# EAGLE design Board_with_LDC1614_no_ind_blink_V4 (EAGLE 9.6.2)
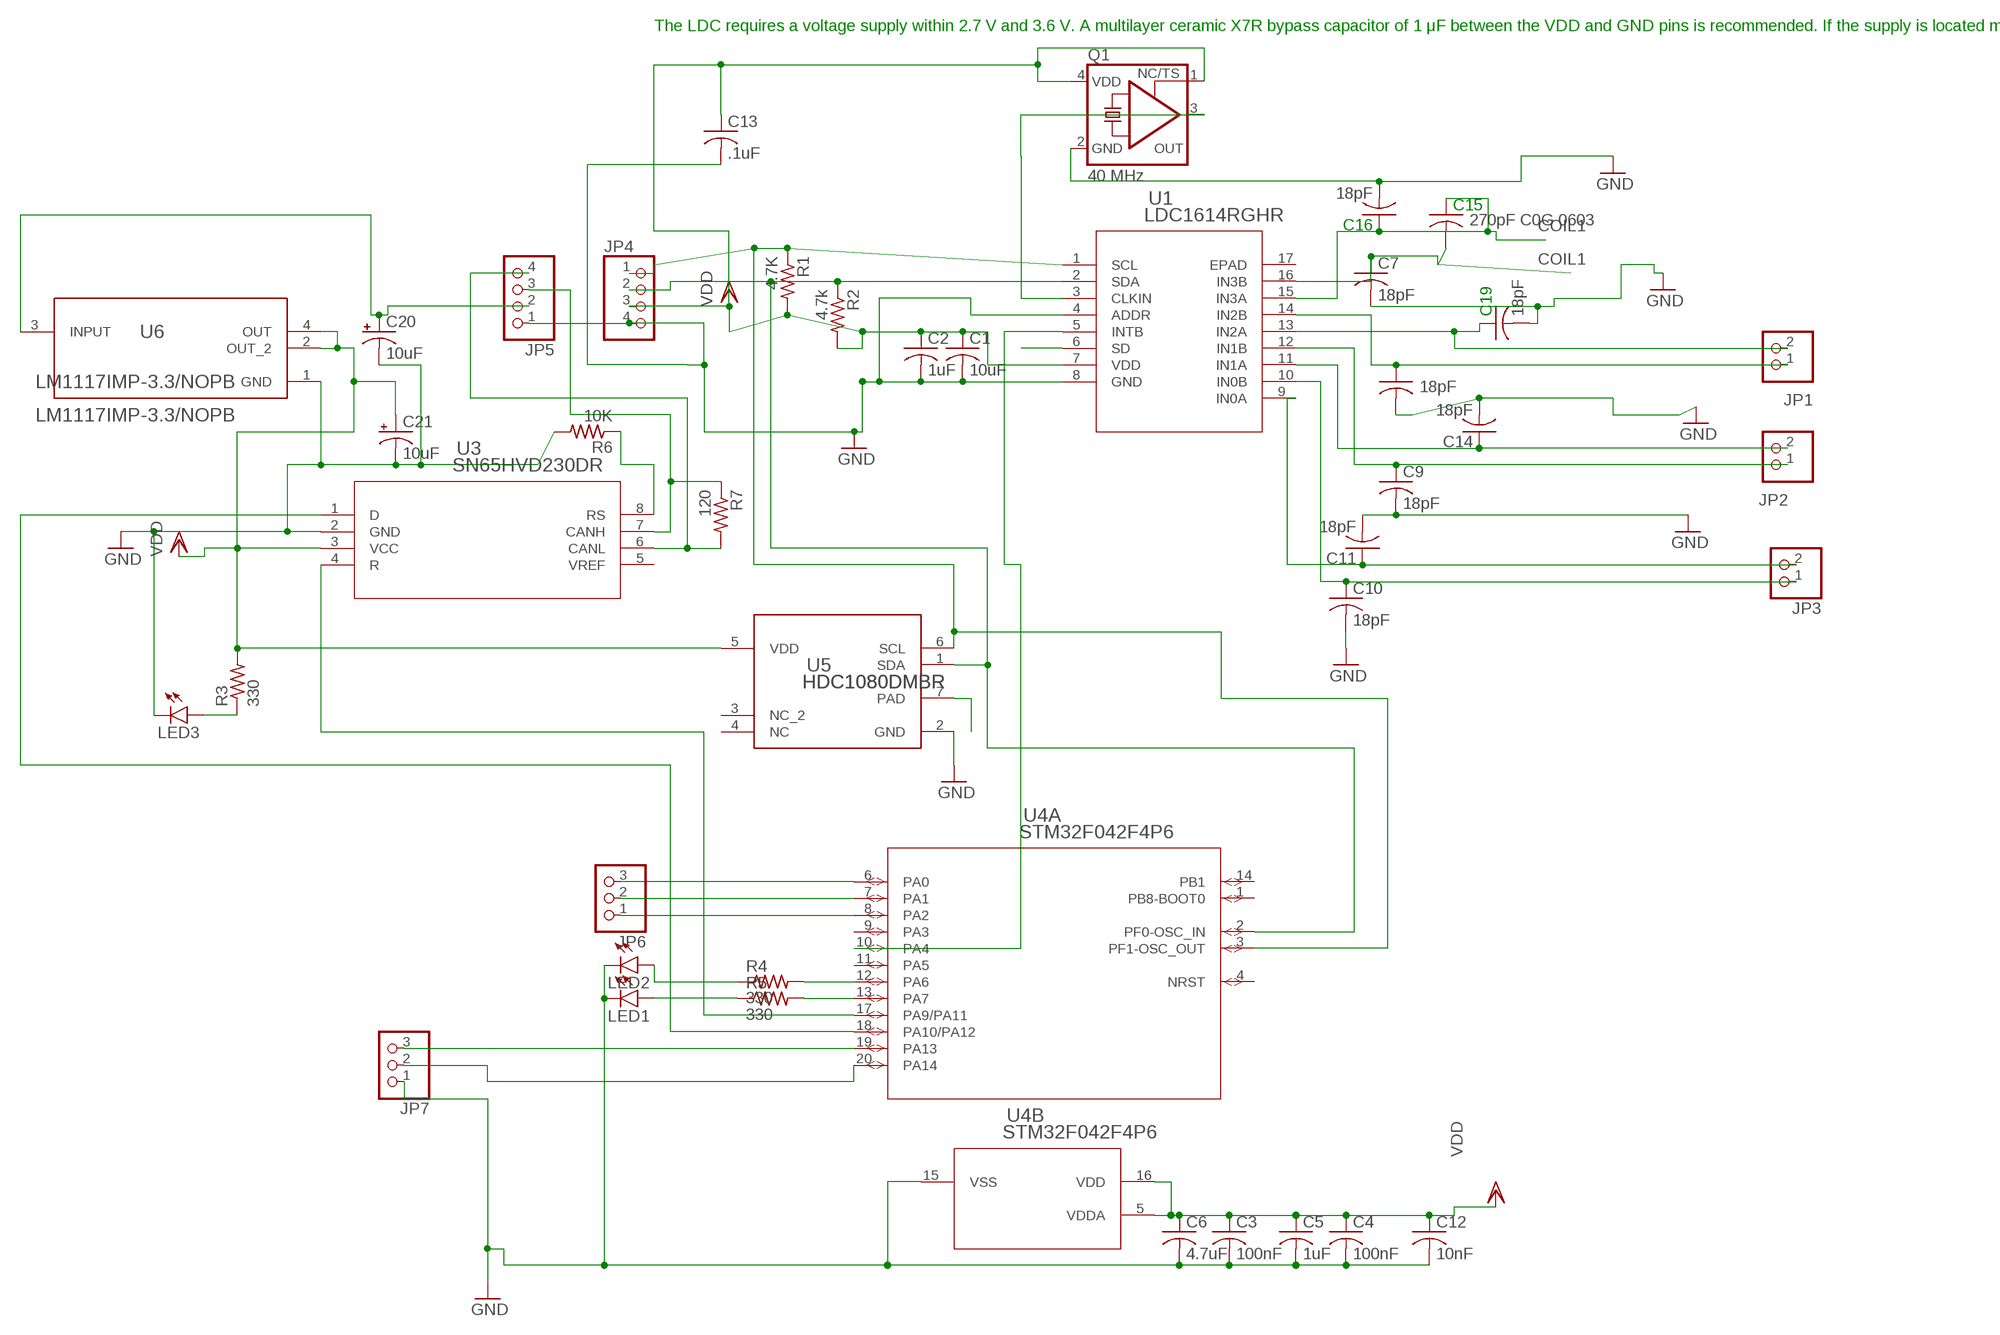
[diagram p0: schematic, sheet 1, part 1 of 2]
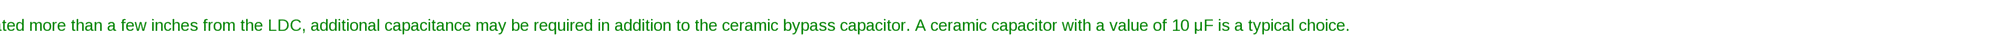
[diagram p1: schematic, sheet 1, part 2 of 2]

## Parts
C1  10uF  C-USC0805  [C0805]
C2  1uF  C-USC0805  [C0805]
C3  100nF  C-USC0805  [C0805]
C4  100nF  C-USC0805  [C0805]
C5  1uF  C-USC0805  [C0805]
C6  4.7uF  C-USC0805  [C0805]
C7  18pF  C-USC0805  [C0805]
C8  18pF  C-USC0805  [C0805]
C9  18pF  C-USC0805  [C0805]
C10  18pF  C-USC0805  [C0805]
C11  18pF  C-USC0805  [C0805]
C12  10nF  C-USC0805  [C0805]
C13  .1uF  C-USC0805  [C0805]
C14  18pF  C-USC0805  [C0805]
C15  270pF C0G 0603  C-USC0805  [C0805]
C16  18pF  C-USC0805  [C0805]
C19  18pF  C-USC0805  [C0805]
C20  10uF  CPOL-USA/3216-18R  [A/3216-18R]
C21  10uF  CPOL-USA/3216-18R  [A/3216-18R]
JP1  PINHD-1X2/90  [1X02/90]
JP2  PINHD-1X2/90  [1X02/90]
JP3  PINHD-1X2/90  [1X02/90]
JP4  PINHD-1X4/90  [1X04/90]
JP5  PINHD-1X4/90  [1X04/90]
JP6  PINHD-1X3  [1X03]
JP7  PINHD-1X3  [1X03]
LED1  LEDSML0603  [SML0603]
LED2  LEDSML0603  [SML0603]
LED3  LEDSML0603  [SML0603]
Q1  40 MHz  KXO-PXO/XO-V95  [2.5X2.0_KXO-V95]
R1  4.7K  R-US_R0805  [R0805]
R2  4.7k  R-US_R0805  [R0805]
R3  330  R-US_R0603  [R0603]
R4  330  R-US_R0603  [R0603]
R5  330  R-US_R0603  [R0603]
R6  10K  R-US_R0603  [R0603]
R7  120  R-US_R0805  [R0805]
U1  LDC1614RGHR  [RGH16_TEX]
U3  SN65HVD230DR  [D8]
U4  STM32F042F4P6  [TSSOP20]
U5  HDC1080DMBR  [DMB0006A]
U6  LM1117IMP-3.3/NOPB  [DCY0004A_N]

## Nets
COIL1: C7.1 C15.1 C15.2 C16.1 U1.15(IN3A) U1.16(IN3B)
GND: C1.2 C2.2 C3.2 C4.2 C5.2 C6.2 C7.2 C8.2 C9.2 C10.2 C11.2 C12.2 C13.2 C14.2 C16.2 C19.2 C20.- C21.- JP4.4 JP5.1 JP7.1 LED1.C LED2.C LED3.C Q1.2(GND) R6.2 U1.4(ADDR) U1.8(GND) U3.2(GND) U4.15(B:VSS) U5.2(GND) U6.1(GND)
INTB: U1.5(INTB) U4.10(A:PA4)
N$1: U5.7(PAD)
N$2: C20.+ JP5.2 U6.3(INPUT)
N$3: JP5.4 R7.2 U3.6(CANL)
N$4: JP5.3 R7.1 U3.7(CANH)
N$5: U3.1(D) U4.18(A:PA10/PA12)
N$6: Q1.3(OUT) U1.3(CLKIN)
N$7: R5.2 U4.13(A:PA7)
N$8: LED1.A R5.1
N$9: LED2.A R4.1
N$10: R4.2 U4.12(A:PA6)
N$11: LED3.A R3.1
N$12: U3.4(R) U4.17(A:PA9/PA11)
N$13: C10.1 JP3.1 U1.10(IN0B)
N$14: C11.1 JP3.2 U1.9(IN0A)
N$15: JP7.2 U4.20(A:PA14)
N$16: C19.1 JP1.2 U1.13(IN2A)
N$17: C8.1 JP1.1 U1.14(IN2B)
N$18: C14.1 JP2.2 U1.11(IN1A)
N$19: C9.1 JP2.1 U1.12(IN1B)
N$21: JP6.3 U4.6(A:PA0)
N$22: JP7.3 U4.19(A:PA13)
N$23: R6.1 U3.8(RS)
N$25: JP6.2 U4.7(A:PA1)
N$26: JP6.1 U4.8(A:PA2)
SCL: JP4.1 R1.1 U1.1(SCL) U4.3(A:PF1-OSC_OUT) U5.6(SCL)
SD: U1.6(SD)
SDA: JP4.2 R2.1 U1.2(SDA) U4.2(A:PF0-OSC_IN) U5.1(SDA)
VDD: C1.1 C2.1 C3.1 C4.1 C5.1 C6.1 C12.1 C13.1 C21.+ JP4.3 Q1.1(TS) Q1.4(VDD) R1.2 R2.2 R3.2 U1.7(VDD) U3.3(VCC) U4.5(B:VDDA) U4.16(B:VDD) U5.5(VDD) U6.2(OUT_2) U6.4(OUT)
Unconnected: U1.17(EPAD) U4.1(A:PB8-BOOT0) U4.4(A:NRST) U4.9(A:PA3) U4.11(A:PA5) U4.14(A:PB1) U5.3(NC_2) U5.4(NC)

## Notes on the sheet
- The LDC requires a voltage supply within 2.7 V and 3.6 V. A multilayer ceramic X7R bypass capacitor of 1 μF between the VDD and GND pins is recommended. If the supply is located more than a few inches from the LDC, additional capacitance may be required in addition to the ceramic bypass capacitor. A ceramic capacitor with a value of 10 μF is a typical choice.

## Power pins joined to a net without a drawn wire
VREF: U3.5(VREF)

## Library data of the parts
C1-C16 C19 = rcl:C-US: CAPACITOR, American symbol; SPICEPREFIX: C
C20 C21 = rcl:CPOL-US: POLARIZED CAPACITOR, American symbol; SPICEPREFIX: C
JP1-JP3 = pinhead:PINHD-1X2: PIN HEADER
JP4 JP5 = pinhead:PINHD-1X4: PIN HEADER
JP6 JP7 = pinhead:PINHD-1X3: PIN HEADER
LED1-LED3 = led:LED: LED OSRAM: - CHIPLED LG R971, LG N971, LY N971, LG Q971, LY Q971, LO R971, LY R971 LH N974, LH R974 LS Q976, LO Q976, LY Q976 LO Q996 - Hyper CHIPLED LW Q18S LB Q993, LB Q99A, LB R99A - SideLED LS A670, LO A670, LY A670, LG A670, LP A670 LB A673, LV A673, LT A673, LW A673 LH A674 LY A675 LS A676, LA A676, LO A676, LY A676, LW A676 LS A679, LY A679, LG A679 - Hyper Micro SIDELED® LS Y876, LA Y876, LO Y876, LY Y876 LT Y87S - SmartLED LW L88C, LW L88S LB L89C, LB L89S, LG L890 LS L89K, LO L89K, LY L89K LS L896, LA L896, LO L896, LY L896 - TOPLED LS T670, LO T670, LY T670, LG T670, LP T670 LSG T670, LSP T670, LSY T670, LOP T670, LYG T670 LG T671, LOG T671, LSG T671 LB T673, LV T673, LT T673, LW T673 LH T674 LS T676, LA T676, LO T676, LY T676, LB T676, LH T676, LSB T676, LW T676 LB T67C, LV T67C, LT T67C, LS T67K, LO T67K, LY T67K, LW E67C LS E67B, LA E67B, LO E67B, LY E67B, LB E67C, LV E67C, LT E67C LW T67C LS T679, LY T679, LG T679 LS T770, LO T770, LY T770, LG T770, LP T770 LB T773, LV T773, LT T773, LW T773 LH T774 LS E675, LA E675, LY E675, LS T675 LS T776, LA T776, LO T776, LY T776, LB T776 LHGB T686 LT T68C, LB T68C - Hyper Mini TOPLED® LB M676 - Mini TOPLED Santana® LG M470 LS M47K, LO M47K, LY M47K Source: http://www.osram.convergy.de LUXEON: - LUMILED® LXK2-PW12-R00, LXK2-PW12-S00, LXK2-PW14-U00, LXK2-PW14-V00 LXK2-PM12-R00, LXK2-PM12-S00, LXK2-PM14-U00 LXK2-PE12-Q00, LXK2-PE12-R00, LXK2-PE12-S00, LXK2-PE14-T00, LXK2-PE14-U00 LXK2-PB12-K00, LXK2-PB12-L00, LXK2-PB12-M00, LXK2-PB14-N00, LXK2-PB14-P00, LXK2-PB14-Q00 LXK2-PR12-L00, LXK2-PR12-M00, LXK2-PR14-Q00, LXK2-PR14-R00 LXK2-PD12-Q00, LXK2-PD12-R00, LXK2-PD12-S00 LXK2-PH12-R00, LXK2-PH12-S00 LXK2-PL12-P00, LXK2-PL12-Q00, LXK2-PL12-R00 Source: www.luxeon.com KINGBRIGHT: KA-3528ASYC Source: www.kingbright.com
Q1 = crystal-geyer_V1_0:KXO-PXO/XO-V: Clock Oscillator (PXO/XO) MHz : KXO-V - Serie Model Size l/w/h [mm] Frequency Range Frequency Stability Temp. Range [°C] Output AECQ 200 availabel Datasheet KXO-V94 KXO-V94 KXO-V95 KXO-V95 KXO-V96 KXO-V96 KXO-V99 KXO-V99 KXO-97 KXO-V97 KXO-97 - KXO-V97 2.0/1.6/0.80 2.0/1.6/0.80 2.5/2.0/0.82 2.5/2.0/0.82 3.2/2.5/1.2 3.2/2.5/1.2 5.0/3.2/1.2 5.0/3.2/1.2 7.0/5.08/1.3 7.0/5.08/1.3 7.0/5.08/1.3 32,768 kHz 1,0 ~ 80,0 MHz 32,768 kHz 1,0 ~ 70,0 MHz 32,768 kHz 1,0 ~ 156,0 MHz 32,768 kHz 1,0 ~ 200,0 MHz 32,768 kHz 32,768 kHz 1,0 ~ 160,0 MHz ±25 … ±100ppm ±25 … ±100ppm ±25 … ±100ppm ±25 … ±100ppm ±25 … ±100ppm ±25 … ±100ppm ±25 … ±100ppm ±25 … ±100ppm ±25 … ±100ppm ±25 … ±100ppm ±25 … ±100ppm (*) -40°C …+85°C (*) -40°C …+85°C (*) -40°C …+85°C (*) -40°C …+85°C (*) -40°C …+85°C (*) -40°C …+85°C (*) -40°C …+85°C (*) -40°C …+85°C (*) -40°C …+85°C (*) -40°C …+85°C (*) -40°C …+85°C HCMOS HCMOS HCMOS HCMOS HCMOS HCMOS HCMOS HCMOS HCMOS HCMOS HCMOS - - yes yes yes yes - - - - - KXO-V94-kHz.pdf <http://www.geyer-electronic.de/uploads/tx_userartikelfrequenz/GEYER-KXO-V94-kHz.pdf> KXO-V94.pdf <http://www.geyer-electronic.de/uploads/tx_userartikelfrequenz/GEYER-KXO-V94.pdf> KXO-V95-kHz.pdf <http://www.geyer-electronic.de/uploads/tx_userartikelfrequenz/GEYER-KXO-V95-kHz.pdf> KXO-V95.pdf <http://www.geyer-electronic.de/uploads/tx_userartikelfrequenz/GEYER-KXO-V95.pdf> KXO-V96-kHz.pdf <http://www.geyer-electronic.de/uploads/tx_userartikelfrequenz/GEYER-KXO-V96-kHz.pdf> KXO-V96.pdf <http://www.geyer-electronic.de/uploads/tx_userartikelfrequenz/GEYER-KXO-V96.pdf> KXO-V99-kHz.pdf <http://www.geyer-electronic.de/uploads/tx_userartikelfrequenz/GEYER-KXO-V99-kHz.pdf> KXO-V99.pdf <http://www.geyer-electronic.de/uploads/tx_userartikelfrequenz/GEYER-KXO-V99.pdf> KXO-97-kHz.pdf <http://www.geyer-electronic.de/uploads/tx_userartikelfrequenz/GEYER-KXO-97-kHz.pdf> KXO-V97-kHz.pdf <http://www.geyer-electronic.de/uploads/tx_userartikelfrequenz/GEYER-KXO-V97-kHz.pdf> KXO-V97.pdf <http://www.geyer-electronic.de/uploads/tx_userartikelfrequenz/GEYER-KXO-V97.pdf> <http://www.geyer-electronic.de/fileadmin/template/img/logo-geyer-electronic.png> Details see: http://www.geyer-electronic.de/Frequenz-Produkte.9.0.html Created 2016-06-07, Hans Locher 2016 (C) Geyer Quartz Technology Hans Locher KXOV94,KXOV95;KXOV96;KXOV97;KXO97;2016;2520;3225;5032;70508;2,5x2,0;3,2x2,5;5,0x3,2;7,0x5,08;2.5x2.0;3.2x2.5;5.0x3.2;7.0x5.08;; LCSC_PART: C390542
R1-R7 = rcl:R-US_: RESISTOR, American symbol; SPICEPREFIX: R
U1 = LDC1614:LDC1614RGHR; COPYRIGHT: Copyright (C) 2022 Ultra Librarian. All rights reserved.; MANUFACTURER_PART_NUMBER: LDC1614RGHR; MFR_NAME: Texas Instruments
U3 = LDC1614:SN65HVD230DR; COPYRIGHT: Copyright (C) 2022 Ultra Librarian. All rights reserved.; DIGI-KEY_PART_NUMBER_1: 296-11654-1-ND; DIGI-KEY_PART_NUMBER_2: 296-11654-2-ND; DIGI-KEY_PART_NUMBER_3: 296-11654-6-ND; DIGI-KEY_PART_NUMBER_4: 2156-SN65HVD230DR-ND; MANUFACTURER_PART_NUMBER: SN65HVD230DR; MFR_NAME: Texas Instruments
U4 = LDC1614:STM32F042F4P6; COPYRIGHT: Copyright (C) 2022 Ultra Librarian. All rights reserved.; DIGI-KEY_PART_NUMBER_1: 497-17343-ND; MANUFACTURER_PART_NUMBER: STM32F042F4P6; MFR_NAME: STMicroelectronics
U5 = LDC1614:HDC1080DMBR; COPYRIGHT: Copyright (C) 2022 Ultra Librarian. All rights reserved.; MANUFACTURER_PART_NUMBER: HDC1080DMBR; MFR_NAME: Texas Instruments; REFDES: RefDes; TYPE: TYPE
U6 = LDC1614:LM1117IMP-3.3/NOPB; COPYRIGHT: Copyright (C) 2022 Ultra Librarian. All rights reserved.; MANUFACTURER_PART_NUMBER: LM1117IMP-3.3/NOPB; MFR_NAME: Texas Instruments; REFDES: RefDes; TYPE: TYPE

## Board
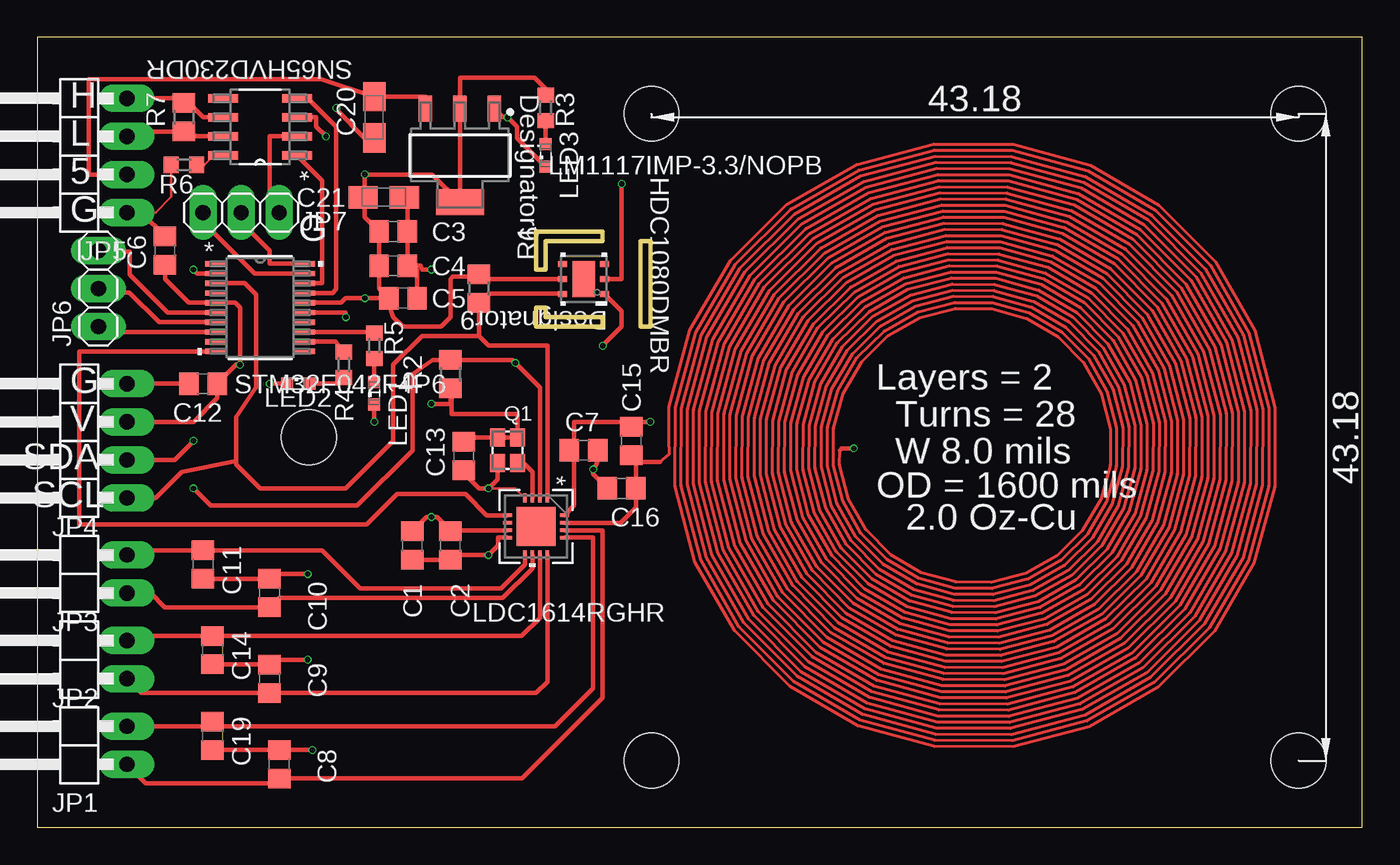
[diagram p2: board, top side]
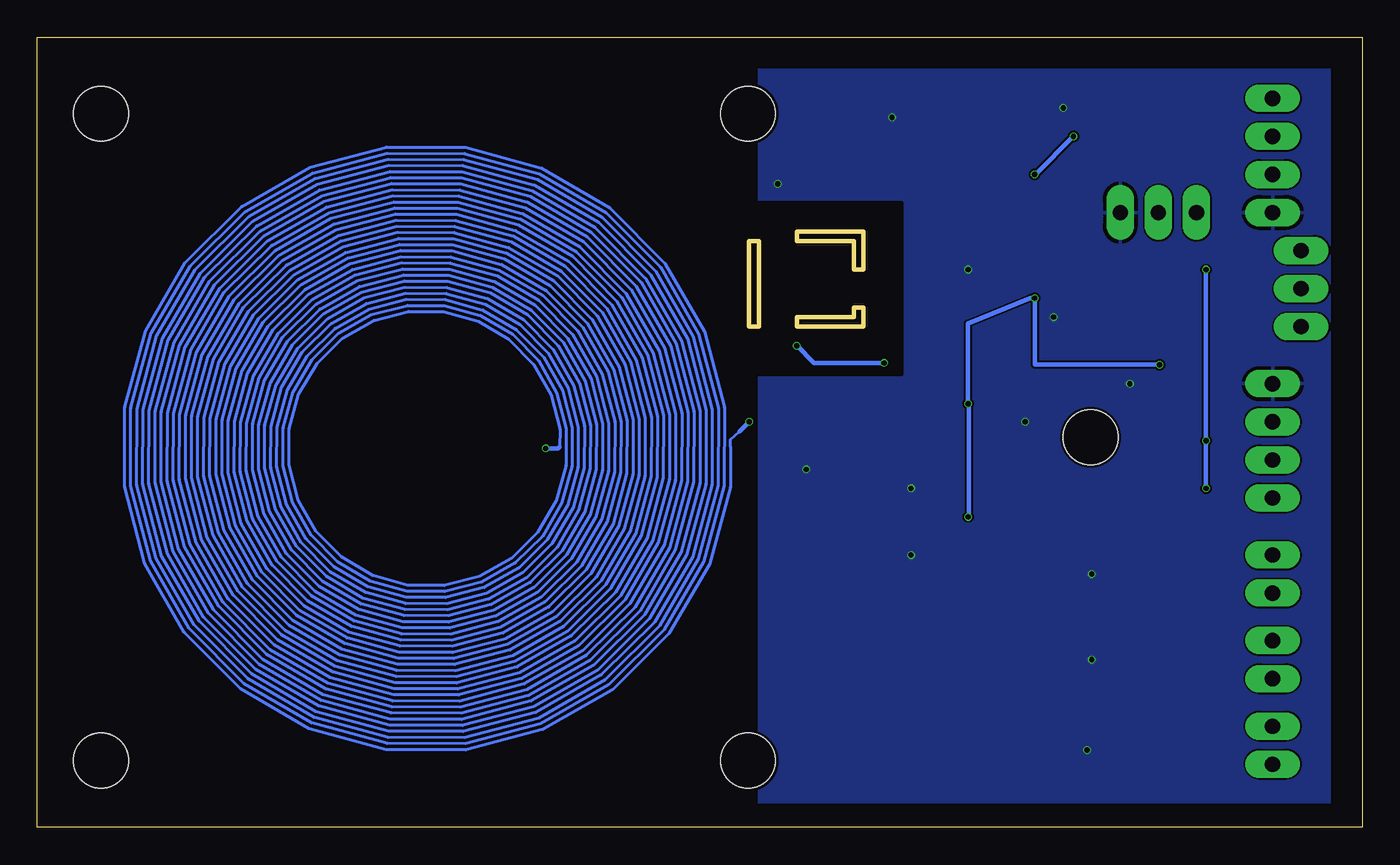
[diagram p3: board, bottom side, seen from below]

Size 88.39 x 52.7 mm. Coordinates in mm from the lower left corner, seen from the top.
Outline: 0,0 88.39,0 88.39,52.7 0,52.7 0,0
Outline: 40.89,39.12 40.89,33.4 40.26,33.4 40.26,39.12 40.89,39.12
Outline: 37.72,39.12 33.91,39.12 33.91,37.21 33.27,37.21 33.27,39.75 37.72,39.75 37.72,39.12
Outline: 37.72,34.04 33.91,34.04 33.91,34.67 33.27,34.67 33.27,33.4 37.72,33.4 37.72,34.04
Copper layers (1*16): TOP 0.035mm / dielectric 1.6mm / BOTTOM 0.035mm
Design rules "jlcpcb-2layers": minimum track width 5mil, minimum drill 0.3mm, track to track 5mil, track to pad 5mil, pad to pad 5mil, via to via 5mil, smd to smd 5mil, copper to edge 0.2mm, drill to drill 6mil, minimum pad ring 10mil, minimum via ring 3mil, stop-mask expansion 4mil, vias tented up to drill 0mil, thermal gap 10mil
Holes 3.66 mm at 40.97,4.43 40.97,47.61 84.15,47.61 84.15,4.43 18.11,26.02

### Footprints (pad centres in the part's own frame; a part is rotated, then mirrored left to right if it is on the bottom)
C0805 = smd 1.3 x 1.5: 1 -0.95,0; 2 0.95,0
A/3216-18R = smd 1.95 x 1.5: + 1.375,0; - -1.375,0
1X02/90 = drill 1.016 long: 1 -1.27,-3.81; 2 1.27,-3.81
1X04/90 = drill 1.016 long: 1 -3.81,-3.81; 2 -1.27,-3.81; 3 1.27,-3.81; 4 3.81,-3.81
1X03 = drill 1.016 long: 1 -2.54,0; 2 0,0; 3 2.54,0
SML0603 = smd 0.8 x 0.8: A 0.75,0; C -0.75,0
2.5X2.0_KXO-V95 = smd 1.2 x 1: 1 -0.85,-0.675; 2 0.85,-0.675; 3 0.85,0.675; 4 -0.85,0.675
R0805 = smd 1.3 x 1.5: 1 -0.95,0; 2 0.95,0
R0603 = smd 1 x 1.1: 1 -0.85,0; 2 0.85,0
RGH16_TEX = smd 0.6 x 0.25: 1 -1.9,0.75; 2 -1.9,0.25; 3 -1.9,-0.25; 4 -1.9,-0.75; 9 1.9,-0.75; 10 1.9,-0.25; 11 1.9,0.25; 12 1.9,0.75 | smd 0.25 x 0.6: 5 -0.75,-1.9; 6 -0.25,-1.9; 7 0.25,-1.9; 8 0.75,-1.9; 13 0.75,1.9; 14 0.25,1.9; 15 -0.25,1.9; 16 -0.75,1.9 | smd 2.6 x 2.6: 17 0,0
D8 = smd 1.981 x 0.559: 1 -2.464,1.905; 2 -2.464,0.635; 3 -2.464,-0.635; 4 -2.464,-1.905; 5 2.464,-1.905; 6 2.464,-0.635; 7 2.464,0.635; 8 2.464,1.905
TSSOP20 = smd 1.473 x 0.356: 1 -2.921,2.925; 2 -2.921,2.275; 3 -2.921,1.625; 4 -2.921,0.975; 5 -2.921,0.325; 6 -2.921,-0.325; 7 -2.921,-0.975; 8 -2.921,-1.625; 9 -2.921,-2.275; 10 -2.921,-2.925; 11 2.921,-2.925; 12 2.921,-2.275; 13 2.921,-1.625; 14 2.921,-0.975; 15 2.921,-0.325; 16 2.921,0.325; 17 2.921,0.975; 18 2.921,1.625; 19 2.921,2.275; 20 2.921,2.925
DMB0006A = smd 0.6 x 0.4: 1 -1.4,1; 2 -1.4,0; 3 -1.4,-1; 4 1.4,-1; 5 1.4,0; 6 1.4,1 | smd 1.5 x 2.4: 7 0,0 | smd 0.5 x 0.5: V -0.5,0
DCY0004A_N = smd 1.75 x 0.9: 1 -3.125,2.3; 2 -3.125,0; 3 -3.125,-2.3 | smd 1.75 x 3.2: 4 3.125,0

### Placement (x,y rotation side)
C1  25.02,18.8 270 top
C2  27.56,18.8 270 top
C3  23.75,39.75 0 top
C4  23.75,37.47 0 top
C5  24.38,35.31 0 top
C6  8.51,38.48 90 top
C7  36.45,25.15 0 top
C8  16.13,4.19 90 top
C9  15.49,9.91 90 top
C10  15.49,15.62 90 top
C11  11.05,17.53 270 top
C12  11.05,29.59 180 top
C13  28.45,24.77 270 top
C14  11.68,11.81 270 top
C15  39.62,25.78 90 top
C16  38.99,22.61 180 top
C19  11.68,6.1 270 top
C20  22.48,47.37 90 top
C21  23.11,42.04 180 top
JP1  2.16,5.46 90 top
JP2  2.16,11.18 90 top
JP3  2.16,16.89 90 top
JP4  2.16,25.78 90 top
JP5  2.16,44.83 90 top
JP6  4.06,35.94 90 top
JP7  13.59,41.02 180 top
LED1  22.48,28.96 90 top
LED2  17.4,29.59 0 top
LED3  33.91,44.83 90 top
Q1  31.37,25.15 270 top
R1  29.46,35.94 90 top
R2  27.56,30.23 270 top
R3  33.91,48.01 90 top
R4  20.45,30.86 90 top
R5  22.48,32.13 90 top
R6  9.78,44.2 180 top
R7  9.78,47.37 90 top
U1  33.27,20.07 270 top
U3  14.86,46.74 180 top
U4  14.86,34.67 0 top
U5  36.45,36.58 180 top
U6  28.19,44.83 270 top

### Tracks (layer width: path | path; a pad name or v marks a point on that pad's centre or on a via)
COIL1  (via drill 0.35)
  TOP 0.152: C15.1 40.09,24.36 | C15.2 39.62,27.05
  TOP 0.203: 53.54,25.15 53.52,24.2 54.12,21.92 55.28,19.86 56.94,18.18 58.99,16.98 61.28,16.35 63.65,16.33 65.96,16.93 68.03,18.11 69.74,19.79 70.95,21.86 71.59,24.17 71.61,26.58 71,28.91 69.81,31.01 68.11,32.73 66.02,33.96 63.68,34.6 61.25,34.62 58.89,34 56.77,32.8 55.03,31.08 53.79,28.97 53.13,26.6 53.12,24.14 53.74,21.76 54.96,19.61 56.69,17.85 58.83,16.6 61.22,15.94 63.71,15.93 66.12,16.55 68.28,17.79 70.06,19.54 71.33,21.7 72,24.12 72.01,26.63 71.38,29.07 70.13,31.26 68.36,33.05 66.17,34.34 63.73,35.01 61.19,35.02 58.73,34.38 56.52,33.12 54.7,31.33 53.41,29.12 52.73,26.66 52.71,24.09 53.36,21.6 54.63,19.36 56.44,17.53 58.67,16.22 61.17,15.54 63.76,15.52 66.27,16.17 68.53,17.46 70.39,19.29 71.71,21.54 72.4,24.06 72.42,26.68 71.76,29.22 70.46,31.51 68.61,33.38 66.33,34.71 63.79,35.41 61.14,35.43 58.57,34.76 56.27,33.45 54.37,31.58 53.03,29.28 52.32,26.71 52.3,24.04 52.98,21.45 54.31,19.11 56.19,17.2 58.52,15.84 61.11,15.13 63.81,15.11 66.43,15.8 68.78,17.14 70.71,19.04 72.09,21.39 72.81,24.01 72.83,26.74 72.14,29.38 70.78,31.76 68.86,33.71 66.49,35.09 63.84,35.82 61.09,35.84 58.42,35.14 56.02,33.77 54.05,31.83 52.65,29.44 51.91,26.76 51.9,23.98 52.6,21.29 53.98,18.87 55.94,16.88 58.36,15.46 61.06,14.72 63.87,14.71 66.59,15.42 69.03,16.81 71.04,18.79 72.47,21.23 73.22,23.96 73.23,26.79 72.51,29.54 71.11,32.01 69.11,34.03 66.65,35.47 63.89,36.23 61.03,36.24 58.26,35.52 55.77,34.1 53.72,32.08 52.27,29.59 51.51,26.82 51.49,23.93 52.22,21.13 53.66,18.62 55.7,16.55 58.2,15.09 61.01,14.32 63.92,14.3 66.74,15.04 69.28,16.48 71.36,18.54 72.84,21.07 73.62,23.9 73.64,26.84 72.89,29.69 71.43,32.25 69.36,34.36 66.8,35.85 63.95,36.63 60.98,36.65 58.1,35.9 55.52,34.42 53.4,32.33 51.89,29.75 51.1,26.87 51.08,23.88 51.84,20.97 53.33,18.37 55.45,16.23 58.05,14.71 60.95,13.91 63.97,13.89 66.9,14.66 69.53,16.16 71.69,18.29 73.22,20.92 74.03,23.85 74.04,26.9 73.27,29.85 71.76,32.51 69.61,34.68 66.96,36.23 64,37.04 60.92,37.06 57.95,36.28 55.27,34.75 53.07,32.58 51.51,29.91 50.7,26.92 50.68,23.82 51.47,20.82 53.01,18.12 55.2,15.9 57.89,14.33 60.9,13.5 64.03,13.49 67.06,14.28 69.78,15.83 72.02,18.04 73.6,20.76 74.43,23.8 74.45,26.95 73.65,30.01 72.08,32.75 69.86,35.01 67.12,36.61 64.05,37.45 60.87,37.46 57.79,36.65 55.02,35.07 52.75,32.83 51.13,30.07 50.29,26.98 50.27,23.77 51.09,20.66 52.68,17.87 54.95,15.58 57.73,13.95 60.85,13.1 64.08,13.08 67.21,13.9 70.03,15.51 72.34,17.79 73.98,20.6 74.84,23.74 74.86,27 74.03,30.16 72.41,33 70.1,35.33 67.27,36.99 64.11,37.85 60.82,37.87 57.63,37.03 54.77,35.4 52.42,33.08 50.76,30.22 49.88,27.03 49.87,23.71 50.71,20.5 52.36,17.62 54.7,15.25 57.57,13.57 60.79,12.69 64.14,12.67 67.37,13.52 70.28,15.18 72.66,17.54 74.36,20.45 75.25,23.69 75.26,27.06 74.41,30.32 72.73,33.25 70.35,35.66 67.43,37.36 64.16,38.26 60.76,38.27 57.48,37.41 54.52,35.72 52.1,33.33 50.38,30.38 49.48,27.08 49.46,23.66 50.33,20.35 52.03,17.37 54.45,14.93 57.42,13.19 60.74,12.28 64.19,12.27 67.53,13.14 70.53,14.86 72.99,17.3 74.74,20.29 75.65,23.64 75.67,27.11 74.79,30.48 73.06,33.5 70.6,35.98 67.59,37.74 64.21,38.66 60.71,38.68 57.32,37.79 54.27,36.05 51.77,33.58 50,30.54 49.07,27.14 49.05,23.61 49.95,20.19 51.7,17.12 54.2,14.6 57.26,12.81 60.69,11.88 64.24,11.86 67.69,12.77 70.78,14.53 73.32,17.05 75.12,20.13 76.06,23.58 76.08,27.16 75.16,30.63 73.38,33.75 70.85,36.31 67.74,38.12 64.27,39.07 60.66,39.09 57.16,38.17 54.02,36.38 51.45,33.83 49.62,30.69 48.66,27.19 48.65,23.55 49.57,20.03 51.38,16.87 53.95,14.28 57.1,12.44 60.63,11.47 64.3,11.46 67.84,12.39 71.03,14.21 73.64,16.8 75.5,19.97 76.47,23.53 76.48,27.22 75.54,30.79 73.71,34 71.1,36.63 67.9,38.5 64.32,39.48 60.6,39.49 57.01,38.55 53.77,36.7 51.12,34.08 49.24,30.85 48.26,27.24 48.24,23.5 49.19,19.88 51.05,16.62 53.7,13.95 56.95,12.06 60.58,11.06 64.35,11.05 68,12.01 71.28,13.88 73.97,16.55 75.88,19.82 76.87,23.48 76.89,27.27 75.92,30.95 74.03,34.25 71.35,36.96 68.06,38.88 64.37,39.88 60.55,39.9 56.85,38.93 53.52,37.02 50.8,34.33 48.86,31.01 47.85,27.3 47.83,23.45 48.81,19.72 50.73,16.37 53.45,13.63 56.79,11.68 60.53,10.66 64.4,10.64 68.16,11.63 71.53,13.56 74.29,16.3 76.25,19.66 77.28,23.42 77.3,27.33 76.3,31.11 74.36,34.5 71.6,37.28 68.21,39.26 64.43,40.29 60.5,40.31 56.69,39.3 53.27,37.35 50.47,34.57 48.48,31.16 47.44,27.35 47.43,23.39 48.44,19.56 50.4,16.12 53.2,13.3 56.63,11.3 60.47,10.25 64.46,10.23 68.31,11.25 71.78,13.23 74.62,16.05 76.63,19.5 77.69,23.37 77.7,27.38 76.68,31.26 74.68,34.75 71.85,37.61 68.37,39.64 64.48,40.7 60.44,40.71 56.54,39.68 53.02,37.68 50.15,34.82 48.1,31.32 47.04,27.4 47.02,23.34 48.06,19.41 50.08,15.87 52.95,12.97 56.48,10.92 60.42,9.85 64.51,9.83 68.47,10.87 72.03,12.91 74.94,15.8 77.01,19.35 78.09,23.32 78.11,27.43 77.06,31.42 75.01,35 72.1,37.93 68.53,40.02 64.53,41.1 60.39,41.12 56.38,40.06 52.77,38 49.82,35.07 47.73,31.48 46.63,27.46 46.61,23.29 47.68,19.25 49.75,15.62 52.7,12.65 56.32,10.54 60.37,9.44 64.56,9.42 68.63,10.49 72.28,12.58 75.27,15.55 77.39,19.19 78.5,23.26 78.52,27.49 77.44,31.57 75.34,35.25 72.35,38.26 68.69,40.39 64.59,41.51 60.34,41.53 56.22,40.44 52.52,38.33 49.5,35.32 47.35,31.63 46.23,27.51 46.21,23.23 47.3,19.09 49.43,15.37 52.45,12.33 56.16,10.16 60.31,9.03 64.62,9.02 68.78,10.12 72.53,12.26 75.59,15.3 77.77,19.03 78.9,23.21 78.92,27.54 77.81,31.73 75.66,35.5 72.6,38.58 68.84,40.77 64.64,41.92 60.28,41.93 56.06,40.82 52.27,38.65 49.17,35.57 46.97,31.79 45.82,27.56 45.8,23.18 46.92,18.93 49.1,15.12 52.2,12 56.01,9.78 60.26,8.63 64.67,8.61 68.94,9.74 72.78,11.93 75.92,15.05 78.15,18.88 79.31,23.16 79.33,27.59 78.19,31.89 75.98,35.75 72.85,38.91 69,41.15 64.69,42.32 60.23,42.34 55.91,41.2 52.03,38.98 48.85,35.82 46.59,31.95 45.41,27.62 45.4,23.13 46.54,18.78 48.78,14.87 51.95,11.67 55.85,9.4 60.2,8.22 64.72,8.2 69.1,9.36 73.03,11.61 76.24,14.8 78.53,18.72 79.72,23.1 79.73,27.65 78.57,32.05 76.31,36 73.1,39.23 69.16,41.53 64.75,42.73 60.18,42.75 55.75,41.58 51.78,39.3 48.52,36.07 46.21,32.1 45.01,27.67 44.99,23.07 46.16,18.62 48.45,14.62 51.7,11.35 55.69,9.03 60.15,7.81 64.78,7.8 69.25,8.98 73.28,11.28 76.57,14.55 78.9,18.56 80.12,23.05 80.14,27.7 78.95,32.2 76.64,36.25 73.35,39.56 69.31,41.91 64.8,43.13 60.12,43.15 55.59,41.96 51.53,39.63 48.2,36.32 45.83,32.26 44.6,27.73 44.58,23.02 45.79,18.46 48.13,14.37 51.45,11.02 55.54,8.65 60.1,7.41 64.83,7.39 69.41,8.6 73.53,10.96 76.89,14.3 79.28,18.41 80.53,22.99 80.55,27.75 79.33,32.36 76.96,36.5 73.6,39.88 69.47,42.29 64.86,43.54 60.07,43.56 55.44,42.34 51.28,39.95 47.87,36.57 45.45,32.42 44.19,27.78 44.18,22.96 45.41,18.31 47.8,14.12 51.2,10.7 55.38,8.27 60.04,7 64.88,6.98 69.57,8.22 73.78,10.63 77.22,14.05 79.66,18.25 80.94,22.94 80.95,27.81 79.71,32.52 77.29,36.75 73.85,40.21 69.63,42.67 64.91,43.95 60.02,43.97 55.28,42.71 51.03,40.28 47.55,36.82 45.08,32.58 43.79,27.83 43.77,22.91 45.03,18.15 47.48,13.87 50.95,10.37 55.22,7.89 59.99,6.6 64.94,6.58 69.72,7.84 74.02,10.31 77.54,13.8 80.04,18.09 81.34,22.89 81.36,27.86 80.09,32.67 77.61,37 74.1,40.54 69.78,43.05 64.96,44.35 59.96,44.37 55.12,43.09 50.78,40.6 47.22,37.07 44.7,32.73 43.38,27.89 43.36,22.86 44.65,17.99 47.15,13.62 50.7,10.05 55.06,7.51 59.94,6.19 64.99,6.17 69.88,7.46 74.27,9.98 77.87,13.55 80.42,17.93 81.75,22.83 81.77,27.91 80.47,32.83 77.94,37.25 74.35,40.86 69.94,43.42 65.02,44.76 59.91,44.78 54.97,43.47 50.53,40.93 46.9,37.32 44.32,32.89 42.97,27.94 42.96,22.8 44.27,17.84 46.83,13.38 50.45,9.72 54.91,7.13 59.88,5.78 65.04,5.77 70.04,7.09 74.52,9.66 78.19,13.3 80.8,17.78 82.16,22.78 82.17,27.97 80.84,32.99 78.26,37.5 74.6,41.19 70.1,43.8 65.07,45.17 59.86,45.18 54.81,43.85 50.28,41.25 46.57,37.57 43.94,33.05 42.57,27.99 42.55,22.75 43.89,17.68 46.5,13.12 50.2,9.4 54.75,6.75 59.83,5.38 65.1,5.36 70.19,6.71 74.77,9.33 78.52,13.05 81.18,17.62 82.56,22.73 82.58,28.02 81.22,33.14 78.59,37.74 74.84,41.51 70.25,44.18 65.12,45.57 59.8,45.59 54.65,44.23 50.03,41.58 46.24,37.82 43.56,33.2 42.16,28.05 42.14,25.37 42.14,24.87 41.53,24.36
  TOP 0.305: 41.53,24.36 40.09,24.36 39.94,24.2 C16.1 39.94,21.34 38.92,20.32 U1.15 | v40.89,27.05 39.62,27.05 35.81,27.05 35.81,25.46 C7.1 35.81,24.83 35.81,21.46 U1.16 | 53.54,25.15 53.66,25.27 v54.48,25.27
  BOTTOM 0.203: 53.54,25.37 53.52,26.55 54.12,28.83 55.28,30.88 56.94,32.57 58.99,33.77 61.28,34.4 63.65,34.41 65.96,33.81 68.03,32.63 69.74,30.96 70.95,28.89 71.59,26.57 71.61,24.17 71,21.84 69.81,19.74 68.11,18.02 66.02,16.79 63.68,16.14 61.25,16.13 58.89,16.74 56.77,17.95 55.03,19.66 53.79,21.78 53.13,24.14 53.12,26.6 53.74,28.99 54.96,31.13 56.69,32.89 58.83,34.15 61.22,34.8 63.71,34.82 66.12,34.19 68.28,32.96 70.06,31.21 71.33,29.05 72,26.63 72.01,24.12 71.38,21.68 70.13,19.49 68.36,17.69 66.17,16.41 63.73,15.74 61.19,15.72 58.73,16.36 56.52,17.62 54.7,19.42 53.41,21.62 52.73,24.09 52.71,26.66 53.36,29.14 54.63,31.38 56.44,33.22 58.67,34.52 61.17,35.21 63.76,35.23 66.27,34.57 68.53,33.29 70.39,31.46 71.71,29.2 72.4,26.68 72.42,24.06 71.76,21.52 70.46,19.24 68.61,17.37 66.33,16.03 63.79,15.33 61.14,15.31 58.57,15.98 56.27,17.3 54.37,19.17 53.03,21.46 52.32,24.04 52.3,26.71 52.98,29.3 54.31,31.63 56.19,33.54 58.52,34.9 61.11,35.62 63.81,35.63 66.43,34.95 68.78,33.61 70.71,31.7 72.09,29.36 72.81,26.73 72.83,24.01 72.14,21.37 70.78,18.99 68.86,17.04 66.49,15.65 63.84,14.93 61.09,14.91 58.42,15.61 56.02,16.97 54.05,18.92 52.65,21.31 51.91,23.98 51.9,26.76 52.6,29.46 53.98,31.88 55.94,33.87 58.36,35.28 61.06,36.02 63.87,36.04 66.59,35.33 69.03,33.94 71.04,31.95 72.47,29.52 73.22,26.79 73.23,23.96 72.51,21.21 71.11,18.74 69.11,16.71 66.65,15.28 63.89,14.52 61.03,14.5 58.26,15.23 55.77,16.65 53.72,18.67 52.27,21.15 51.51,23.93 51.49,26.82 52.22,29.61 53.66,32.13 55.7,34.19 58.2,35.66 61.01,36.43 63.92,36.45 66.74,35.71 69.28,34.26 71.36,32.2 72.84,29.67 73.62,26.84 73.64,23.9 72.89,21.05 71.43,18.49 69.36,16.39 66.8,14.9 63.95,14.11 60.98,14.1 58.1,14.85 55.52,16.32 53.4,18.42 51.89,20.99 51.1,23.88 51.08,26.87 51.84,29.77 53.33,32.38 55.45,34.52 58.05,36.04 60.95,36.84 63.97,36.85 66.9,36.09 69.53,34.59 71.69,32.45 73.22,29.83 74.03,26.89 74.04,23.85 73.27,20.9 71.76,18.24 69.61,16.06 66.96,14.52 64,13.71 60.92,13.69 57.95,14.47 55.27,16 53.07,18.17 51.51,20.84 50.7,23.82 50.68,26.92 51.47,29.93 53.01,32.63 55.2,34.84 57.89,36.42 60.9,37.24 64.03,37.26 67.06,36.47 69.78,34.91 72.02,32.7 73.6,29.99 74.43,26.95 74.45,23.8 73.65,20.74 72.08,17.99 69.86,15.74 67.12,14.14 64.05,13.3 60.87,13.28 57.79,14.09 55.02,15.67 52.75,17.92 51.13,20.68 50.29,23.77 50.27,26.98 51.09,30.09 52.68,32.88 54.95,35.17 57.73,36.8 60.85,37.65 64.08,37.67 67.21,36.84 70.03,35.24 72.34,32.95 73.98,30.14 74.84,27 74.86,23.74 74.03,20.58 72.41,17.74 70.1,15.41 67.27,13.76 64.11,12.89 60.82,12.88 57.63,13.71 54.77,15.35 52.42,17.67 50.76,20.52 49.88,23.72 49.87,27.03 50.71,30.24 52.36,33.13 54.7,35.49 57.57,37.17 60.79,38.05 64.14,38.07 67.37,37.22 70.28,35.56 72.66,33.2 74.36,30.3 75.25,27.06 75.26,23.69 74.41,20.43 72.73,17.49 70.35,15.09 67.43,13.38 64.16,12.49 60.76,12.47 57.48,13.33 54.52,15.02 52.1,17.42 50.38,20.37 49.48,23.66 49.46,27.09 50.33,30.4 52.03,33.38 54.45,35.82 57.42,37.55 60.74,38.46 64.19,38.48 67.53,37.6 70.53,35.89 72.99,33.45 74.74,30.46 75.65,27.11 75.67,23.63 74.79,20.27 73.06,17.24 70.6,14.76 67.59,13 64.21,12.08 60.71,12.06 57.32,12.96 54.27,14.7 51.77,17.17 50,20.21 49.07,23.61 49.05,27.14 49.95,30.56 51.7,33.63 54.2,36.15 57.26,37.93 60.69,38.87 64.24,38.88 67.69,37.98 70.78,36.21 73.32,33.7 75.12,30.61 76.06,27.16 76.08,23.58 75.16,20.11 73.38,16.99 70.85,14.44 67.74,12.62 64.27,11.68 60.66,11.66 57.16,12.58 54.02,14.37 51.45,16.92 49.62,20.05 48.66,23.56 48.65,27.19 49.57,30.71 51.38,33.88 53.95,36.47 57.1,38.31 60.63,39.27 64.3,39.29 67.84,38.36 71.03,36.54 73.64,33.95 75.5,30.77 76.47,27.22 76.48,23.53 75.54,19.96 73.71,16.74 71.1,14.11 67.9,12.25 64.32,11.27 60.6,11.25 57.01,12.2 53.77,14.05 51.12,16.67 49.24,19.9 48.26,23.5 48.24,27.25 49.19,30.87 51.05,34.13 53.7,36.8 56.95,38.69 60.58,39.68 64.35,39.7 68,38.74 71.28,36.86 73.97,34.2 75.88,30.93 76.87,27.27 76.89,23.47 75.92,19.8 74.03,16.49 71.35,13.79 68.06,11.87 64.37,10.86 60.55,10.85 56.85,11.82 53.52,13.72 50.8,16.42 48.86,19.74 47.85,23.45 47.83,27.3 48.81,31.03 50.73,34.38 53.45,37.12 56.79,39.07 60.53,40.09 64.4,40.1 68.16,39.12 71.53,37.19 74.29,34.45 76.25,31.09 77.28,27.32 77.3,23.42 76.3,19.64 74.36,16.25 71.6,13.46 68.21,11.49 64.43,10.46 60.5,10.44 56.69,11.44 53.27,13.39 50.47,16.17 48.48,19.58 47.44,23.4 47.43,27.35 48.44,31.18 50.4,34.63 53.2,37.45 56.63,39.45 60.47,40.49 64.46,40.51 68.31,39.49 71.78,37.51 74.62,34.7 76.63,31.24 77.69,27.38 77.7,23.37 76.68,19.48 74.68,16 71.85,13.14 68.37,11.11 64.48,10.05 60.44,10.03 56.54,11.06 53.02,13.07 50.15,15.92 48.1,19.43 47.04,23.34 47.02,27.41 48.06,31.34 50.08,34.88 52.95,37.77 56.48,39.83 60.42,40.9 64.51,40.92 68.47,39.87 72.03,37.84 74.94,34.95 77.01,31.4 78.09,27.43 78.11,23.31 77.06,19.33 75.01,15.75 72.1,12.81 68.53,10.73 64.53,9.64 60.39,9.63 56.38,10.68 52.77,12.75 49.82,15.67 47.73,19.27 46.63,23.29 46.61,27.46 47.68,31.5 49.75,35.12 52.7,38.1 56.32,40.2 60.37,41.31 64.56,41.32 68.63,40.25 72.28,38.16 75.27,35.2 77.39,31.56 78.5,27.48 78.52,23.26 77.44,19.17 75.34,15.5 72.35,12.49 68.69,10.35 64.59,9.24 60.34,9.22 56.22,10.3 52.52,12.42 49.5,15.42 47.35,19.11 46.23,23.23 46.21,27.51 47.3,31.65 49.43,35.38 52.45,38.42 56.16,40.58 60.31,41.71 64.62,41.73 68.78,40.63 72.53,38.49 75.59,35.45 77.77,31.71 78.9,27.54 78.92,23.21 77.81,19.01 75.66,15.25 72.6,12.16 68.84,9.97 64.64,8.83 60.28,8.81 56.06,9.93 52.27,12.1 49.17,15.17 46.97,18.96 45.82,23.18 45.8,27.57 46.92,31.81 49.1,35.62 52.2,38.75 56.01,40.96 60.26,42.12 64.67,42.14 68.94,41.01 72.78,38.81 75.92,35.7 78.15,31.87 79.31,27.59 79.33,23.15 78.19,18.86 75.98,15 72.85,11.84 69,9.59 64.69,8.42 60.23,8.41 55.91,9.55 52.03,11.77 48.85,14.92 46.59,18.8 45.41,23.13 45.4,27.62 46.54,31.97 48.78,35.87 51.95,39.07 55.85,41.34 60.2,42.53 64.72,42.54 69.1,41.39 73.03,39.14 76.24,35.95 78.53,32.03 79.72,27.64 79.73,23.1 78.57,18.7 76.31,14.75 73.1,11.51 69.16,9.22 64.75,8.02 60.18,8 55.75,9.17 51.78,11.44 48.52,14.68 46.21,18.64 45.01,23.07 44.99,27.67 46.16,32.12 48.45,36.12 51.7,39.4 55.69,41.72 60.15,42.93 64.78,42.95 69.25,41.77 73.28,39.46 76.57,36.2 78.9,32.18 80.12,27.7 80.14,23.05 78.95,18.54 76.64,14.5 73.35,11.19 69.31,8.84 64.8,7.61 60.12,7.59 55.59,8.79 51.53,11.12 48.2,14.43 45.83,18.48 44.6,23.02 44.58,27.73 45.79,32.28 48.13,36.37 51.45,39.72 55.54,42.1 60.1,43.34 64.83,43.35 69.41,42.15 73.53,39.79 76.89,36.45 79.28,32.34 80.53,27.75 80.55,22.99 79.33,18.39 76.96,14.25 73.6,10.86 69.47,8.46 64.86,7.2 60.07,7.19 55.44,8.41 51.28,10.79 47.87,14.18 45.45,18.33 44.19,22.97 44.18,27.78 45.41,32.44 47.8,36.62 51.2,40.05 55.38,42.48 60.04,43.74 64.88,43.76 69.57,42.52 73.78,40.12 77.22,36.7 79.66,32.5 80.94,27.8 80.95,22.94 79.71,18.23 77.29,14 73.85,10.54 69.63,8.08 64.91,6.8 60.02,6.78 55.28,8.03 51.03,10.47 47.55,13.93 45.08,18.17 43.79,22.91 43.77,27.83 45.03,32.59 47.48,36.87 50.95,40.37 55.22,42.86 59.99,44.15 64.94,44.17 69.72,42.9 74.02,40.44 77.54,36.95 80.04,32.65 81.34,27.86 81.36,22.89 80.09,18.07 77.61,13.75 74.1,10.21 69.78,7.7 64.96,6.39 59.96,6.38 55.12,7.65 50.78,10.14 47.22,13.68 44.7,18.01 43.38,22.86 43.36,27.89 44.65,32.75 47.15,37.12 50.7,40.7 55.06,43.23 59.94,44.56 64.99,44.57 69.88,43.28 74.27,40.77 77.87,37.19 80.42,32.81 81.75,27.91 81.77,22.83 80.47,17.92 77.94,13.5 74.35,9.89 69.94,7.32 65.02,5.99 59.91,5.97 54.97,7.28 50.53,9.82 46.9,13.43 44.32,17.86 42.97,22.81 42.96,27.94 44.27,32.91 46.83,37.37 50.45,41.02 54.91,43.61 59.88,44.96 65.04,44.98 70.04,43.66 74.52,41.09 78.19,37.44 80.8,32.97 82.16,27.96 82.17,22.78 80.84,17.76 78.26,13.25 74.6,9.56 70.1,6.94 65.07,5.58 59.86,5.56 54.81,6.9 50.28,9.49 46.57,13.18 43.94,17.7 42.57,22.75 42.55,27.99 43.89,33.06 46.5,37.62 50.2,41.35 54.75,43.99 59.83,45.37 65.1,45.39 70.19,44.04 74.77,41.42 78.52,37.69 81.18,33.12 82.56,28.02 82.58,22.73 81.22,17.6 78.59,13 74.84,9.23 70.25,6.57 65.12,5.17 59.8,5.16 54.65,6.52 50.03,9.17 46.24,12.93 43.56,17.54 42.16,22.7 42.14,25.37 42.14,25.88 41.53,26.39
  BOTTOM 0.305: 41.53,26.39 40.89,27.03 v40.89,27.05 | 53.54,25.37 53.64,25.27 v54.48,25.27
GND  (via drill 0.35)
  TOP 0.152: 30.69,23.8 Q1.2 | U1.4 31.88,22.61 v30.1,22.61 | R6.2 8.93,42.08 7.87,41.02 6.6,41.02
  TOP 0.305: C19.2 C8.2 v18.35,5.14 | C14.2 C9.2 15.81,11.18 v18.03,11.18 | C11.2 C10.2 15.81,16.89 v18.03,16.89 | C7.2 37.57,25.02 37.27,24.13 v37.08,23.88 37.08,23.56 C16.2 | Q1.2 30.69,23.2 v30.1,22.61 29.46,22.61 28.17,23.9 C13.2 | U3.2 15.49,46.1 15.49,42.29 16.13,41.66 JP7.1 | C20.- 21.84,46 19.94,47.9 v19.94,48.01 | U1.8 30.73,19.32 30.73,18.8 v30.1,18.16 27.87,18.16 C2.2 C1.2 | v38.99,42.93 38.99,36.58 U5.2 | U4.15 20.57,34.35 v20.57,34.04 | C4.2 C3.2 24.7,41.45 C21.- | C4.2 25.33,37.21 C5.2 | C4.2 25.55,37.47 25.65,37.21 v26.29,37.21 | JP4.4 C12.2 | C6.2 6.92,41.02 6.6,41.02 JP5.1 | LED2.C v15.49,29.59 | LED1.C v22.48,27.05 | LED3.C 32,45.99 32,46.74 v31.37,47.37 31.08,47.37 U6.1
  pour BOTTOM: 2.16,1.65 40.26,1.65 40.26,50.55 2.16,50.55
  pour BOTTOM: 2.16,1.65 40.26,1.65 40.26,50.55 2.16,50.55
INTB
  TOP 0.305: U4.10 2.79,31.75 2.79,20.19 21.97,20.19 24,22.22 28.58,22.22 29.98,20.82 U1.5
N$2
  TOP 0.305: JP5.2 3.43,43.56 3.43,49.91 18.93,49.91 C20.+ 25.89,48.75 U6.3
N$3
  TOP 0.305: 9.78,48.64 JP5.4 | U3.6 11.05,47.37 9.78,48.64 | R7.2 9.78,48.64
N$4
  TOP 0.305: U3.7 10.1,46.1 R7.1 6.29,46.42 JP5.3
N$5
  TOP 0.305: U4.18 19.01,36.3 19.01,43.14 U3.1
N$6
  TOP 0.305: U1.3 33.02,23.7 32.43,24.3 Q1.3
N$7
  TOP 0.305: U4.13 22.41,33.05 R5.2
N$8
  TOP 0.305: R5.1 LED1.A
N$9
  TOP 0.305: R4.1 20.15,29.59 LED2.A
N$10
  TOP 0.305: U4.12 19.89,32.4 R4.2
N$11
  TOP 0.305: R3.1 LED3.A
N$12
  TOP 0.305: U3.4 18.03,48.64 19.94,46.74 19.94,35.9 19.69,35.65 U4.17
N$13
  TOP 0.305: JP3.1 7.55,15.62 8.5,14.67 C10.1 16.13,15.31 31.05,15.31 33.02,17.28 U1.10
N$14
  TOP 0.305: JP3.2 6.28,18.48 C11.1 18.99,18.48 21.53,15.94 30.93,15.94 32.52,17.53 U1.9
N$15
  TOP 0.305: U4.20 15.49,37.6 15.49,38.48 13.59,40.39 JP7.2
N$16
  TOP 0.305: U1.13 37.08,19.32 37.08,9.27 34.54,6.73 12,6.73 C19.1 11.37,6.73 JP1.2
N$17
  TOP 0.305: JP1.1 7.24,2.92 15.81,2.92 C8.1 32.34,3.24 37.72,8.62 37.72,19.82 U1.14
N$18
  TOP 0.305: JP2.2 6.28,12.76 C14.1 32.32,12.76 33.52,13.97 U1.11
N$19
  TOP 0.305: JP2.1 6.92,8.96 C9.1 33.27,8.96 34.02,9.71 U1.12
N$21
  TOP 0.305: U4.6 8.7,34.35 6.17,36.88 6.17,38.42 4.13,38.42 JP6.3
N$22
  TOP 0.305: U4.19 14.49,36.95 11.05,40.39 JP7.3
N$23
  TOP 0.152: U3.8 11.76,44.83 11.13,44.2 R6.1
N$25
  TOP 0.305: U4.7 8.13,33.7 6.14,35.69 4.32,35.69 JP6.2
N$26
  TOP 0.305: U4.8 5.69,33.05 5.33,33.4 JP6.1
SCL
  TOP 0.305: 29.46,32.77 25.65,32.77 23.75,30.86 23.75,25.78 20.57,22.61 14.86,22.61 13.27,24.19 13.27,24.45 | 13.27,24.45 13.27,27.37 14.61,29.37 14.61,35.53 13.84,36.3 U4.3 | 13.27,24.45 9.62,23.72 7.87,21.97 JP4.1 | U1.1 34.02,32.13 30.1,32.13 29.46,32.77 | 29.46,32.77 R1.1 30.1,35.63 35,35.63 U5.6
SDA  (via drill 0.35)
  TOP 0.305: v10.41,22.61 11.57,21.45 21.32,21.45 25.02,25.15 25.02,30.25 26.37,31.18 R2.1 31.69,31.18 v31.89,30.98 33.52,29.34 U1.2 | U4.2 10.82,36.94 10.8,36.96 10.67,36.96 v10.41,37.21 | v37.72,32.13 38.99,33.4 38.99,34.44 U5.1 | v10.41,25.78 9.14,24.51 JP4.2
  BOTTOM 0.305: v10.41,37.21 v10.41,25.78 v10.41,22.61 | v31.89,30.98 36.56,30.98 v37.72,32.13
UNFILLED
  cutout BOTTOM: 30.73,41.66 40.89,41.66 40.89,30.23 30.73,30.23
UNGROUNDED
  pour TOP: 35.81,37.85 37.08,37.85 37.08,35.31 35.81,35.31
VDD  (via drill 0.35)
  TOP 0.305: U3.3 17.35,47.4 18.59,47.4 18.59,46.76 v19.26,46.1 | U4.16 20.25,35 20.56,35.31 v21.84,35.31 C5.1 | U1.7 27.56,19.82 | U5.5 29.78,36.58 29.62,36.73 | R1.2 29.62,36.73 | C6.1 8.51,36.58 10.09,35 U4.5 13.19,35 13.51,34.67 v13.51,30.86 13.27,30.86 C12.1 12,28.64 10.41,27.05 JP4.3 | C5.1 22.8,35.94 C4.1 C3.1 | 22.16,40.39 C3.1 | C2.1 27.56,19.82 | 28.45,26.04 C13.1 28.73,26 Q1.1 Q1.4 32.04,27.49 31.97,27.57 27.65,27.57 27.65,29.19 R2.2 27.56,28.25 v26.29,28.25 | C1.1 25.97,20.7 v26.29,20.7 26.67,20.7 27.56,19.82 | 33.16,50.02 33.17,50.02 | C5.1 23.43,34.99 23.75,34.04 24.38,33.4 26.92,33.4 27.56,34.04 27.56,36.58 27.72,36.73 29.62,36.73 | 33.17,50.02 28.2,50.02 28.19,50.02 U6.2 U6.4 26.34,43.56 v21.84,43.56 21.84,41.76 | 33.17,50.02 33.91,49.28 R3.2 | 21.84,41.76 C21.+ | C3.1 21.84,40.71 21.84,41.76
  BOTTOM 0.305: v26.29,20.7 26.22,20.77 26.22,28.19 v26.29,28.25 26.29,33.6 22.14,35.31 v21.84,35.31 21.84,30.86 v13.51,30.86 | v19.26,46.1 21.8,43.56 v21.84,43.56

### Text on the board
ASSYNOTES: H | L | 5 | G | G | G | Layers = 2 | V | Turns = 28 | W 8.0 mils | SDA | OD = 1600 mils | SCL | 2.0 Oz-Cu